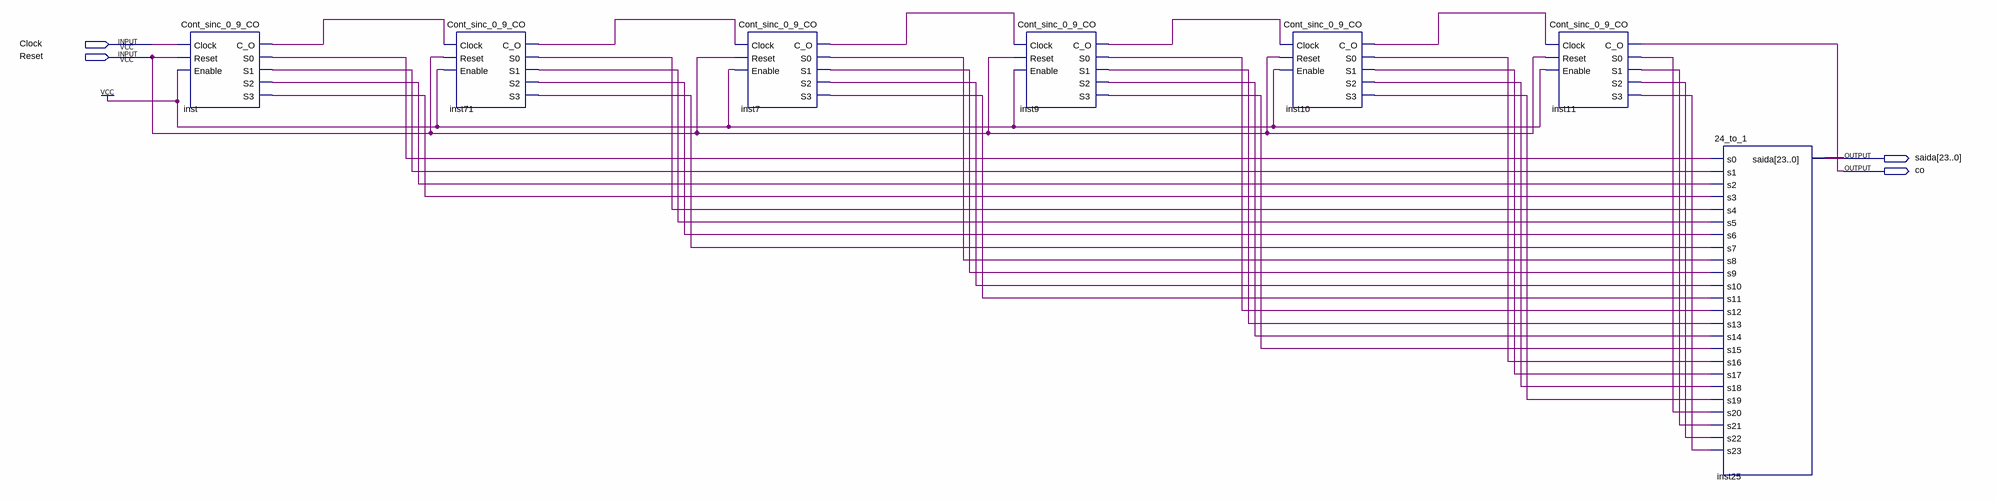
[diagram p0: schematic sheet]
// Quartus schematic Contador_frequencimetro.bdf as structural Verilog: 7 symbols, 4 pins
module Contador_frequencimetro (
  input  Clock,
  input  Reset,
  output [23:0] saida,
  output co
);

  wire inst7_c_o, inst7_s0, inst7_s1, inst7_s2, inst7_s3, inst9_c_o, inst9_s0, inst9_s1, inst9_s2, inst9_s3,
       inst10_c_o, inst10_s0, inst10_s1, inst10_s2, inst10_s3, inst11_s0, inst11_s1, inst11_s2, inst11_s3,
       inst71_c_o, inst71_s0, inst71_s1, inst71_s2, inst71_s3, inst_c_o, inst_s0, inst_s1, inst_s2, inst_s3;

  Cont_sinc_0_9_CO inst (
    .Clock(Clock), .Reset(Reset), .Enable(1'b1), .C_O(inst_c_o), .S0(inst_s0), .S1(inst_s1), .S2(inst_s2),
    .S3(inst_s3));
  Cont_sinc_0_9_CO inst71 (
    .Clock(inst_c_o), .Reset(Reset), .Enable(1'b1), .C_O(inst71_c_o), .S0(inst71_s0), .S1(inst71_s1),
    .S2(inst71_s2), .S3(inst71_s3));
  Cont_sinc_0_9_CO inst7 (
    .Clock(inst71_c_o), .Reset(Reset), .Enable(1'b1), .C_O(inst7_c_o), .S0(inst7_s0), .S1(inst7_s1),
    .S2(inst7_s2), .S3(inst7_s3));
  Cont_sinc_0_9_CO inst9 (
    .Clock(inst7_c_o), .Reset(Reset), .Enable(1'b1), .C_O(inst9_c_o), .S0(inst9_s0), .S1(inst9_s1),
    .S2(inst9_s2), .S3(inst9_s3));
  Cont_sinc_0_9_CO inst10 (
    .Clock(inst9_c_o), .Reset(Reset), .Enable(1'b1), .C_O(inst10_c_o), .S0(inst10_s0), .S1(inst10_s1),
    .S2(inst10_s2), .S3(inst10_s3));
  Cont_sinc_0_9_CO inst11 (
    .Clock(inst10_c_o), .Reset(Reset), .Enable(1'b1), .C_O(co), .S0(inst11_s0), .S1(inst11_s1),
    .S2(inst11_s2), .S3(inst11_s3));
  \24_to_1  inst25 (
    .s0(inst_s0), .s1(inst_s1), .s2(inst_s2), .s3(inst_s3), .s4(inst71_s0), .s5(inst71_s1), .s6(inst71_s2),
    .s7(inst71_s3), .s8(inst7_s0), .s9(inst7_s1), .s10(inst7_s2), .s11(inst7_s3), .s12(inst9_s0),
    .s13(inst9_s1), .s14(inst9_s2), .s15(inst9_s3), .s16(inst10_s0), .s17(inst10_s1), .s18(inst10_s2),
    .s19(inst10_s3), .s20(inst11_s0), .s21(inst11_s1), .s22(inst11_s2), .s23(inst11_s3), .saida(saida));
endmodule
